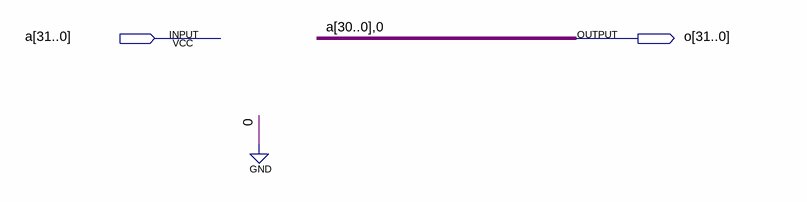
[diagram p0: schematic sheet]
// Quartus schematic LOG_SL32.bdf as structural Verilog: 0 symbols, 2 pins
module LOG_SL32 (
  input  [31:0] a,
  output [31:0] o
);


  assign o = {a[30:0], 1'b0};
endmodule
